# EAGLE design IoT_Bee_hive_scale (EAGLE 9.5.2)
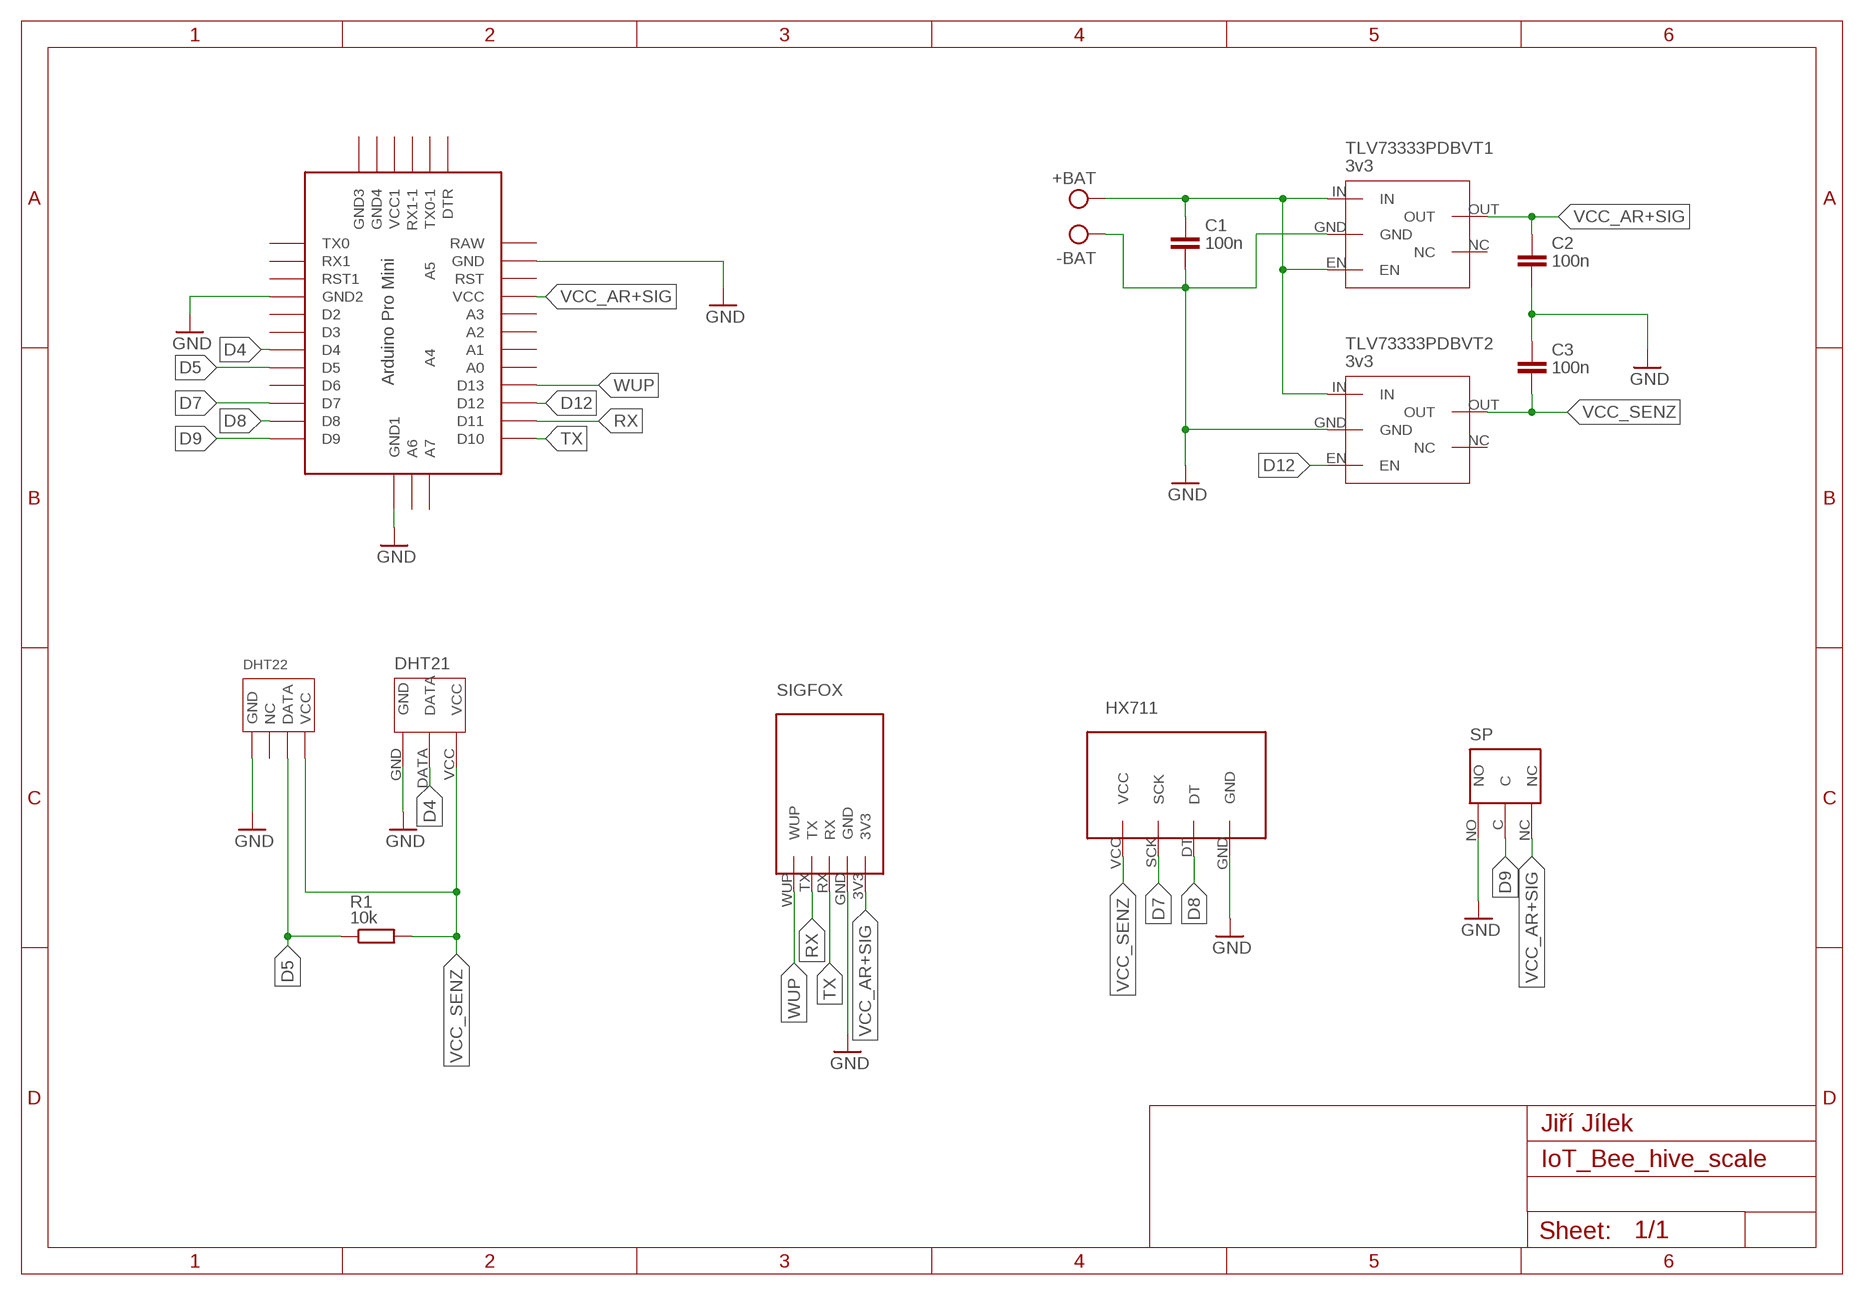
[diagram p0: schematic, sheet 1]

## Parts
+BAT  3.7V  AK300/2  [AK300/2]
C1  100n  C-EUC1206  [C1206]
C2  100n  C-EUC1206  [C1206]
C3  100n  C-EUC1206  [C1206]
DHT21  0  DHT21  [DHT21]
DHT22  DHT22  [DHT22]
HX711  0  HX711  [HX711]
R1  10k  R-EU_R0805  [R0805]
SIGFOX  0  SIGFOX_NODE  [SIGFOX_NODE]
SP  0  MIKROSP  [MIKROSP]
TLV73333PDBVT1  3v3  TLV73333PDBVT  [SOT95P280X145-5N]
TLV73333PDBVT2  3v3  TLV73333PDBVT  [SOT95P280X145-5N]
U$1  ABK-PRO-MINI  [ABK-PRO-MINI]

## Nets
D4 [DATA]: DHT21.DATA U$1.D4
D5 [DATA]: DHT22.DATA R1.1 U$1.D5
D7 [DATA]: HX711.SCK U$1.D7
D8 [DATA]: HX711.DT U$1.D8
D9 [DATA]: SP.C U$1.D9
D12 [DATA]: TLV73333PDBVT2.EN U$1.D12
GND: +BAT.2 C1.2 C2.2 C3.1 DHT21.GND DHT22.GND HX711.GND SIGFOX.GND SP.NO TLV73333PDBVT1.GND TLV73333PDBVT2.GND U$1.GND U$1.GND1(GND2) U$1.GND4(GND1)
RX [DATA]: SIGFOX.TX U$1.D11
TX [DATA]: SIGFOX.RX U$1.D10
VCC: +BAT.1 C1.1 TLV73333PDBVT1.EN TLV73333PDBVT1.IN TLV73333PDBVT2.IN
VCC_AR+SIG [Vcc]: C2.1 SIGFOX.3V3 SP.NC TLV73333PDBVT1.OUT U$1.VCC
VCC_SENZ [Vcc]: C3.2 DHT21.VCC DHT22.VCC HX711.VCC R1.2 TLV73333PDBVT2.OUT
WUP [DATA]: SIGFOX.WUP U$1.D13
Unconnected: DHT22.NC TLV73333PDBVT1.NC TLV73333PDBVT2.NC U$1.A0 U$1.A1 U$1.A2 U$1.A3 U$1.A4 U$1.A5 U$1.A6 U$1.A7 U$1.D2 U$1.D3 U$1.D6 U$1.DTR U$1.GND2(GND3) U$1.GND3(GND4) U$1.RAW U$1.RST U$1.RST1 U$1.RX1 U$1.RX1-1 U$1.TX0 U$1.TX0-1 U$1.VCC1

## Notes on the sheet
- +BAT
- -BAT
- Jiří Jílek

## Library data of the parts
+BAT = con-ptr500:AK300/2: CONNECTOR; OC_FARNELL: unknown; OC_NEWARK: unknown
C1-C3 = rcl:C-EU: CAPACITOR, European symbol; SPICEPREFIX: C
DHT21 = DHT21:DHT21
DHT22 = DHT22:DHT22: 314010001; AVAILABILITY: Unavailable; DESCRIPTION: AM2302 Humidity, Temperature Sensor Grove Platform Evaluation Expansion Board; MF: Seeed Technology; MP: AM2302; PACKAGE: Housed Sensor Seeed Technology; PRICE: None
HX711 = HX711:HX711
R1 = rcl:R-EU_: RESISTOR, European symbol; SPICEPREFIX: R
SIGFOX = Sigfox_node:SIGFOX_NODE
SP = mikro_spinac:MIKROSP
TLV73333PDBVT1 TLV73333PDBVT2 = TLV73333PDBVT:TLV73333PDBVT
U$1 = Arduino-clone:ABK-PRO-MINI: ABK Pro-Mini Arduino Clone

## Board
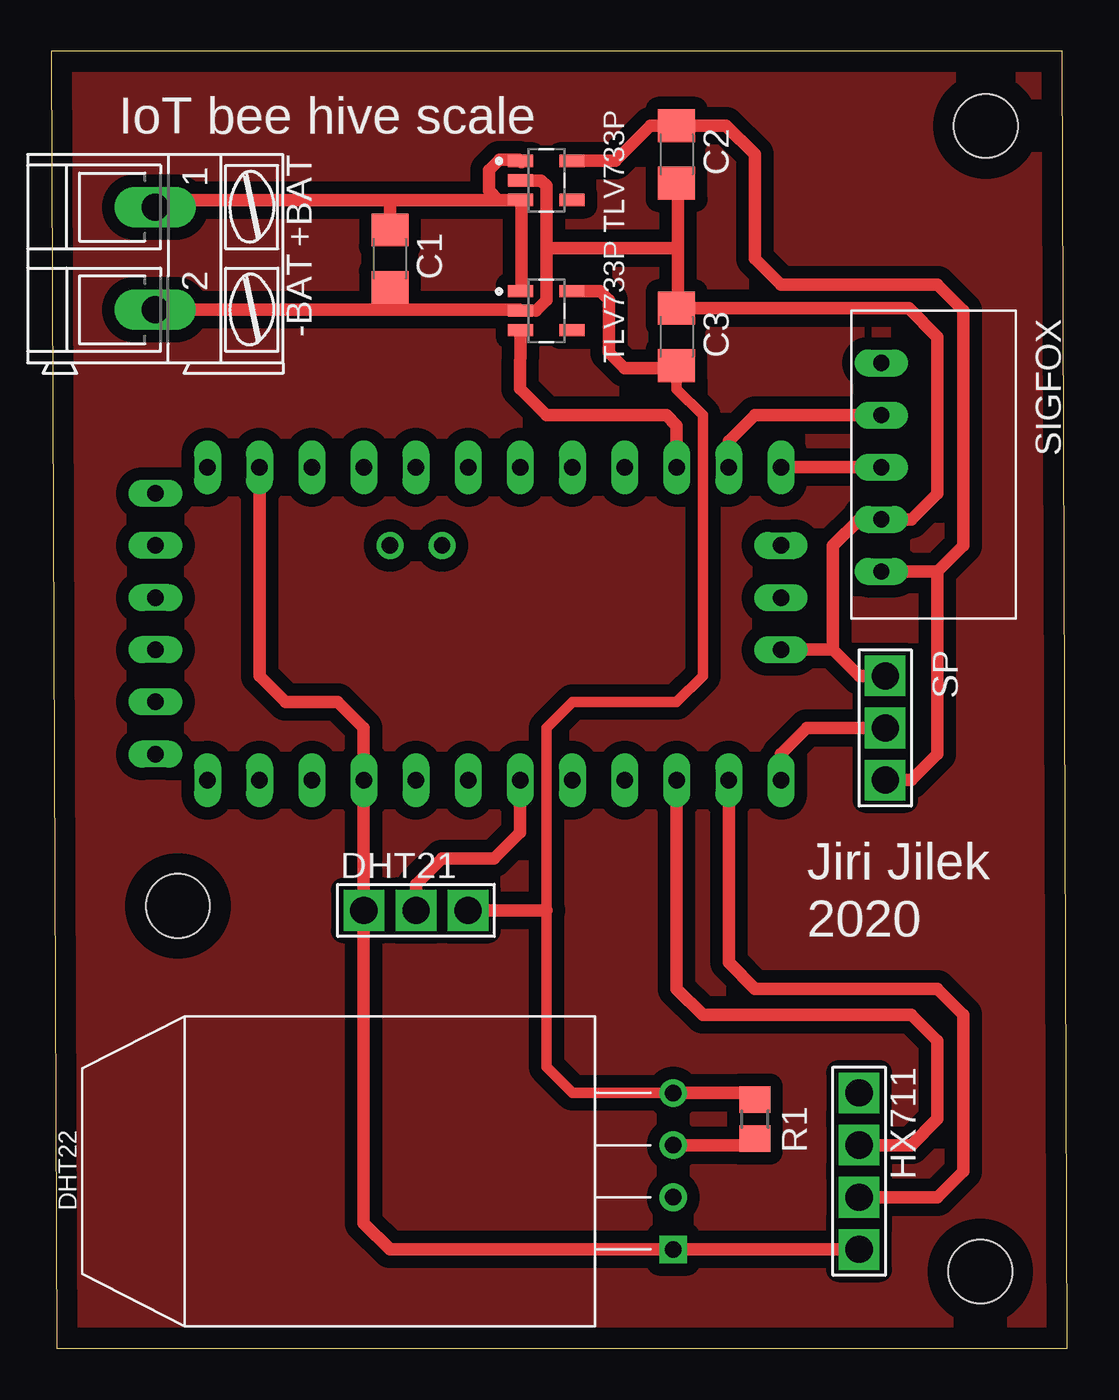
[diagram p1: board, top side]
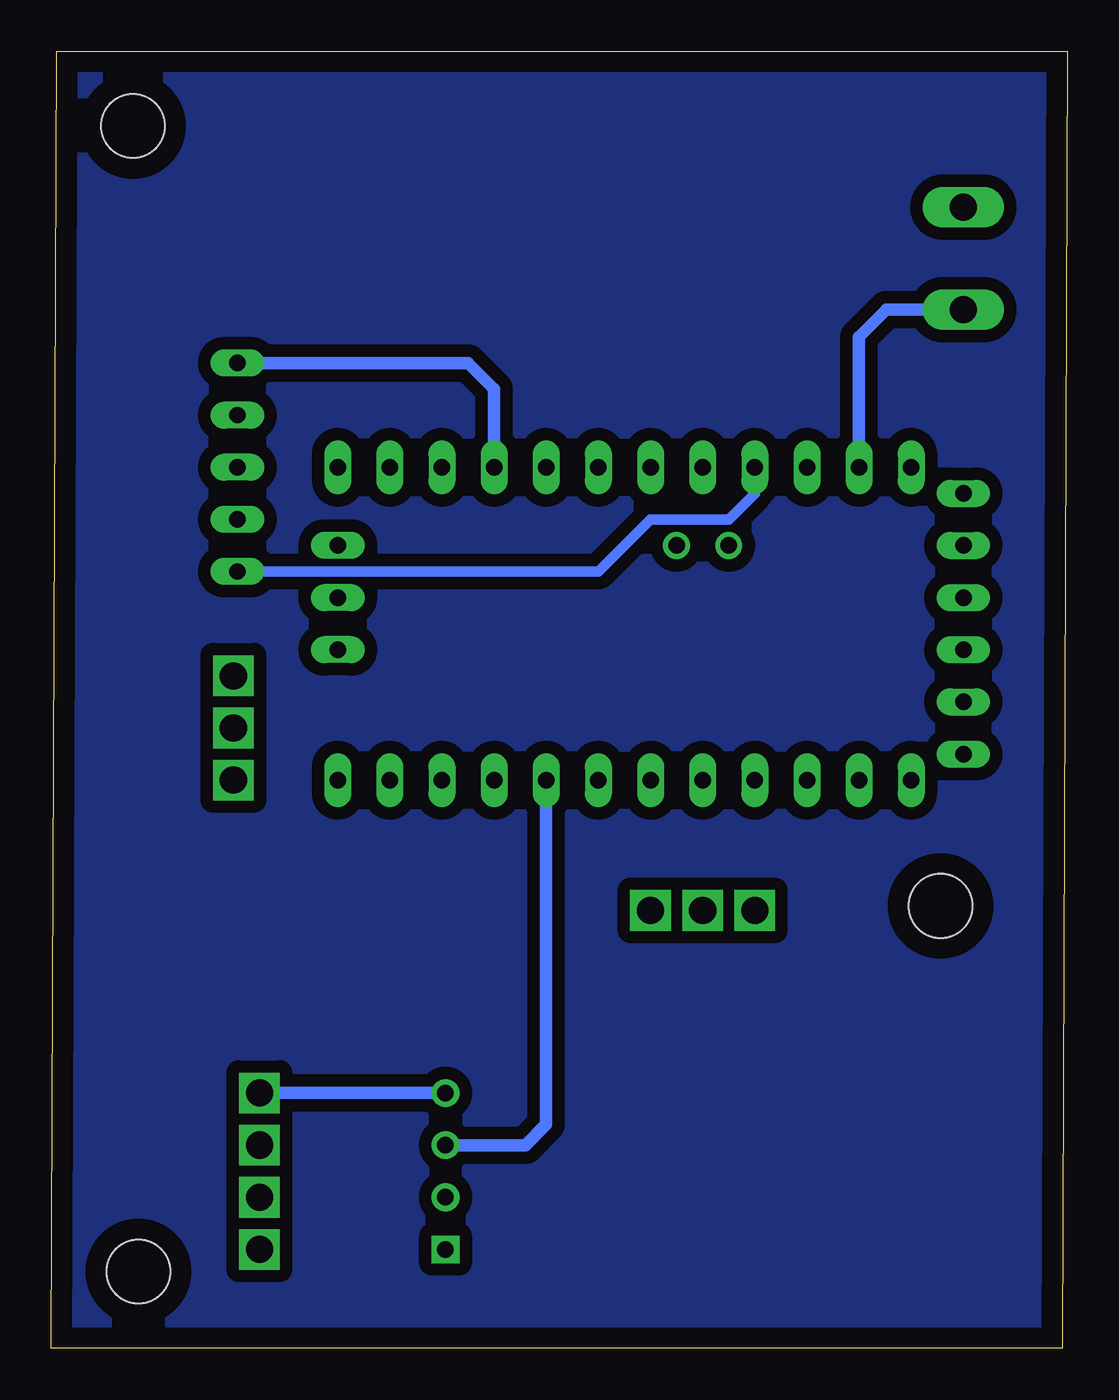
[diagram p2: board, bottom side, seen from below]

Size 49.49 x 63.17 mm. Coordinates in mm from the lower left corner, seen from the top.
Outline: 0,63.17 0.25,0 49.49,0 49.24,63.17 0,63.17
Copper layers (1*16): Top 0.035mm / dielectric 1.5mm / Bottom 0.035mm
Design rules "default": minimum track width 6mil, minimum drill 0.35mm, track to track 6mil, track to pad 6mil, pad to pad 6mil, via to via 6mil, smd to smd 6mil, copper to edge 40mil, drill to drill 6mil, minimum pad ring 10mil, minimum via ring 8mil, stop-mask expansion 4mil, vias tented up to drill 0mil, thermal gap 10mil
Holes 3.1 mm at 45.52,59.54 45.25,3.73 6.17,21.54

### Footprints (pad centres in the part's own frame; a part is rotated, then mirrored left to right if it is on the bottom)
AK300/2 = drill 1.321 long: 1 -2.515,0; 2 2.489,0
C1206 = smd 1.6 x 1.8: 1 -1.4,0; 2 1.4,0
DHT21 = drill 1.321 square: DATA 3.81,-1.27; GND 1.27,-1.27; VCC 6.35,-1.27
DHT22 = drill 0.8 pad 1.35: DATA 1.27,-13.8; NC -1.27,-13.8; VCC 3.81,-13.8 | drill 0.8 pad 1.35 square: GND -3.81,-13.8
HX711 = drill 1.321 square: DT 6.35,-1.27; GND 8.89,-1.27; SCK 3.81,-1.27; VCC 1.27,-1.27
R0805 = smd 1.3 x 1.5: 1 -0.95,0; 2 0.95,0
SIGFOX_NODE = drill 0.8 long: 3V3 12.7,-6.54; GND 10.16,-6.54; RX 7.62,-6.54; TX 5.08,-6.54; WUP 2.54,-6.54
MIKROSP = drill 1.321 square: C 3.81,-1.27; NC 6.35,-1.27; NO 1.27,-1.27
SOT95P280X145-5N = smd 0.59 x 1.21: EN 0.95,-1.255; GND 0,-1.255; IN -0.95,-1.255; NC 0.95,1.255; OUT -0.95,1.255
ABK-PRO-MINI = drill 0.8 long: A0 10.16,-3.81; A1 10.16,-6.35; A2 10.16,-8.89; A3 10.16,-11.43; A6 3.81,-21.59; A7 6.35,-21.59; D2 -5.08,-3.81; D3 -5.08,-6.35; D4 -5.08,-8.89; D5 -5.08,-11.43; D6 -5.08,-13.97; D7 -5.08,-16.51; D8 -5.08,-19.05; D9 -5.08,-21.59; D10 10.16,-21.59; D11 10.16,-19.05; D12 10.16,-16.51; D13 10.16,-13.97; DTR 8.89,8.89; GND 10.16,3.81; GND1 -5.08,-1.27; GND2 -3.81,8.89; GND3 -1.27,8.89; GND4 1.27,-21.59; RAW 10.16,6.35; RST 10.16,1.27; RST1 -5.08,1.27; RX1 -5.08,3.81; RX1-1 3.81,8.89; TX0 -5.08,6.35; TX0-1 6.35,8.89; VCC 10.16,-1.27; VCC1 1.27,8.89 | drill 0.8: A4 6.35,-5.08; A5 6.35,-2.54

### Placement (x,y rotation side)
+BAT  5.06,53.07 270 top
C1  16.49,53.07 270 top
C2  30.46,58.15 270 top
C3  30.46,49.26 270 top
DHT21  13.95,22.59 0 top
DHT22  16.49,8.62 90 top
HX711  40.62,13.7 270 top
R1  34.27,11.16 90 top
SIGFOX  46.97,50.53 270 top
SP  41.89,34.02 270 top
TLV73333PDBVT1  24.11,56.88 270 top
TLV73333PDBVT2  24.11,50.53 270 top
U$1  13.95,32.75 90 top

### Tracks (layer width: path | path; a pad name or v marks a point on that pad's centre or on a via)
D4
  Top 0.61: U$1.D4 22.84,25.13 21.57,23.86 19.03,23.86 17.76,22.59 DHT21.DATA
D5
  Top 0.152: 30.59,10.14 30.36,9.91 DHT22.DATA | 34.25,10.14 R1.1
  Top 0.406: 33.99,9.89 34.25,10.14
  Top 0.61: DHT22.DATA 33.99,9.89
  Bottom 0.152: 25.41,27.67 U$1.D5 | 30.29,9.91 DHT22.DATA
  Bottom 0.61: DHT22.DATA 26.4,9.89 25.38,10.91 U$1.D5
D7
  Top 0.61: HX711.SCK 41.89,9.89 43.16,11.16 43.16,14.97 41.89,16.24 31.73,16.24 30.46,17.51 U$1.D7
D8
  Top 0.152: U$1.D8 33.03,27.64
  Top 0.61: U$1.D8 33,18.78 34.27,17.51 43.16,17.51 44.43,16.24 44.43,8.62 43.16,7.35 HX711.DT
D9
  Top 0.61: U$1.D9 35.54,28.94 36.81,30.21 SP.C
D12
  Top 0.61: TLV73333PDBVT2.EN 22.83,46.73 24.11,45.45 29.96,45.45 30.46,44.94 U$1.D12
GND
  Top 0.152: 15.2,27.67 U$1.GND1 | 16.49,51.6 C1.2 | 22.51,56.93 22.82,56.93 TLV73333PDBVT1.GND | 30.52,50.61 C3.1 30.52,50.68 | 30.44,56.78 C2.2 30.52,56.7 | 23.2,50.53 TLV73333PDBVT2.GND
  Top 0.406: 30.52,50.78 30.52,50.68 | 23.61,50.53 23.2,50.53
  Top 0.61: U$1.GND 10.14,32.75 11.41,31.48 13.95,31.48 15.22,30.21 U$1.GND1 DHT21.GND 15.22,6.08 16.49,4.81 DHT22.GND HX711.GND | U$1.GND4 38.08,34.02 | 38.08,34.02 38.08,39.1 39.35,40.37 SIGFOX.GND 41.89,40.37 43.16,41.64 43.16,49.26 41.76,50.66 C3.1 | TLV73333PDBVT1.GND 23.86,56.88 24.11,56.63 24.11,53.58 | 30.52,56.7 30.52,53.58 | 30.52,53.58 30.52,50.78 | 30.52,53.58 24.11,53.58 | 24.11,53.58 24.11,51.04 23.61,50.53 | TLV73333PDBVT2.GND 22.81,50.58 16.49,50.58 | +BAT.2 16.49,50.58 | C1.2 16.49,50.58 | SP.NO 39.35,32.75 38.08,34.02
  Bottom 0.61: U$1.GND 10.14,49.26 8.82,50.58 +BAT.2
RX
  Top 0.61: SIGFOX.TX 34.27,45.45 33,44.18 U$1.D11
S$1
  pour Top (isolate 0.61): -0.02,63.23 49.26,63.23 49.51,62.98 49.51,-0.27 0.24,-0.27 -0.02,-0.02
S$2
  pour Bottom (isolate 0.61): -0.02,63.23 49.26,63.23 49.51,62.98 49.51,60.69 49.51,-0.27 -0.02,-0.27
TX
  Top 0.61: SIGFOX.RX U$1.D10
VCC
  Top 0.152: 22.89,51.52 TLV73333PDBVT2.IN | 23.12,55.86 22.97,55.86 TLV73333PDBVT1.EN 22.89,55.86
  Top 0.406: 22.79,57.9 TLV73333PDBVT1.IN
  Top 0.61: 22.89,57.77 TLV73333PDBVT1.IN | 22.79,57.9 21.83,57.9 21.32,57.39 21.32,56.37 21.76,55.93 | 22.89,55.86 22.89,51.52 | TLV73333PDBVT1.EN 21.76,55.93 | +BAT.1 5.41,55.93 16.49,55.93 | 16.49,55.93 21.76,55.93 | C1.1 16.49,55.93
VCC_AR+SIG
  Top 0.152: C2.1 30.99,59.55
  Top 0.61: 43.16,37.83 SIGFOX.3V3 | 43.16,37.83 43.16,28.94 41.89,27.67 SP.NC | TLV73333PDBVT1.OUT 25.41,57.84 27.49,57.84 29.2,59.55 C2.1 32.87,59.55 34.27,58.15 34.27,53.07 35.54,51.8 43.16,51.8 44.43,50.53 44.43,39.1 43.16,37.83
  Bottom 0.508: SIGFOX.3V3 22.84,37.83 20.3,40.37 16.49,40.37 15.22,41.64 U$1.VCC
VCC_SENZ
  Top 0.152: 34.25,12.12 R1.2 | 30.67,12.12 30.36,12.43 DHT22.VCC | 25.41,51.44 TLV73333PDBVT2.OUT | 30.52,47.79 C3.2
  Top 0.406: 33.94,12.43 34.25,12.12 | 30.46,47.74 30.52,47.79
  Top 0.508: DHT22.VCC 25.38,12.43 24.11,13.7 24.11,21.32 24.11,30.21 25.38,31.48 30.46,31.48 31.73,32.75 31.73,45.45 30.46,46.72 30.46,47.74
  Top 0.61: DHT22.VCC 33.94,12.43 | TLV73333PDBVT2.OUT 26.72,51.48 27.16,51.04 27.16,48.5 27.92,47.74 30.46,47.74 | DHT21.VCC 24.11,21.32
  Bottom 0.61: 32.75,12.43 DHT22.VCC HX711.VCC
WUP
  Bottom 0.61: U$1.D13 27.92,46.72 29.19,47.99 SIGFOX.WUP

### Text on the board
tNames: IoT bee hive scale | +BAT | TLV733P | -BAT | TLV733P | Jiri Jilek | 2020